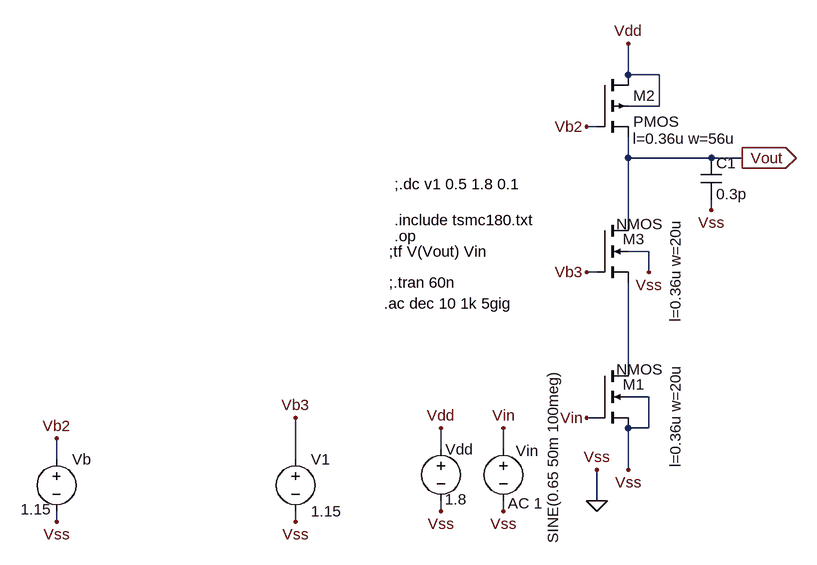
[diagram p0: schematic Cascode_CSA with current source with 1Ghz.asc]
Cascode_CSA with current source with 1Ghz.asc, the LTspice schematic file:
Version 4
SHEET 1 1056 680
WIRE 496 -368 496 -416
WIRE 544 -368 496 -368
WIRE 544 -320 544 -368
WIRE 544 -320 496 -320
WIRE 448 -288 432 -288
WIRE 496 -240 496 -272
WIRE 624 -240 496 -240
WIRE 672 -240 624 -240
WIRE 624 -160 624 -176
WIRE 496 -144 496 -240
WIRE 528 -96 496 -96
WIRE 448 -64 432 -64
WIRE 528 -64 528 -96
WIRE 496 80 496 -48
WIRE 528 128 496 128
WIRE 448 160 432 160
WIRE 528 176 528 128
WIRE 528 176 496 176
WIRE 208 208 208 176
WIRE 304 208 304 176
WIRE -384 224 -384 192
WIRE -16 224 -16 160
WIRE 496 240 496 176
WIRE 448 288 448 240
WIRE 208 304 208 288
WIRE 304 304 304 288
WIRE -384 320 -384 304
WIRE -16 320 -16 304
FLAG 448 288 0
FLAG 448 240 Vss
FLAG 304 176 Vin
FLAG 208 304 Vss
FLAG 304 304 Vss
FLAG 208 176 Vdd
FLAG 496 -416 Vdd
FLAG 496 240 Vss
FLAG 672 -240 Vout
IOPIN 672 -240 Out
FLAG 624 -160 Vss
FLAG 432 160 Vin
FLAG -384 320 Vss
FLAG -384 192 Vb2
FLAG 528 -64 Vss
FLAG 432 -64 Vb3
FLAG -16 320 Vss
FLAG -16 160 Vb3
FLAG 432 -288 Vb2
SYMBOL nmos4 448 80 R0
WINDOW 0 40 29 Left 2
WINDOW 3 30 6 Left 2
WINDOW 123 121 -2 VRight 2
SYMATTR InstName M1
SYMATTR Value2 l=0.36u w=20u
SYMBOL voltage 208 192 R0
WINDOW 123 0 0 Left 0
WINDOW 39 0 0 Left 0
WINDOW 0 7 17 Left 2
WINDOW 3 6 94 Left 2
SYMATTR InstName Vdd
SYMATTR Value 1.8
SYMBOL voltage 304 192 R0
WINDOW 0 19 19 Left 2
WINDOW 3 76 -106 VRight 2
WINDOW 123 7 100 Left 2
WINDOW 39 0 0 Left 0
SYMATTR InstName Vin
SYMATTR Value SINE(0.65 50m 100meg)
SYMATTR Value2 AC 1
SYMBOL cap 608 -240 R0
SYMATTR InstName C1
SYMATTR Value 0.3p
SYMBOL voltage -384 208 R0
WINDOW 123 0 0 Left 0
WINDOW 39 0 0 Left 0
WINDOW 3 -55 93 Left 2
SYMATTR Value 1.15
SYMATTR InstName Vb
SYMBOL nmos4 448 -144 R0
WINDOW 0 40 29 Left 2
WINDOW 3 30 6 Left 2
WINDOW 123 121 -2 VRight 2
SYMATTR InstName M3
SYMATTR Value2 l=0.36u w=20u
SYMBOL voltage -16 208 R0
WINDOW 123 0 0 Left 0
WINDOW 39 0 0 Left 0
SYMATTR InstName V1
SYMATTR Value 1.15
SYMBOL pmos4 448 -368 R0
WINDOW 123 55 98 Left 2
SYMATTR Value2 l=0.36u w=56u
SYMATTR InstName M2
TEXT 136 -144 Left 2 !.include tsmc180.txt
TEXT 136 -120 Left 2 !.op
TEXT 128 -96 Left 2 !;tf V(Vout) Vin
TEXT 120 -16 Left 2 !.ac dec 10 1k 5gig
TEXT 128 -48 Left 2 !;.tran 60n
TEXT 136 -200 Left 2 !;.dc v1 0.5 1.8 0.1

The netlist it stands for:
* Cascode_CSA with current source with 1Ghz.asc
M1 N001 Vin 0 0 NMOS l=0.36u w=20u
Vdd Vdd 0 1.8
Vin Vin 0 SINE(0.65 50m 100meg) AC 1
C1 Vout 0 0.3p
Vb Vb2 0 1.15
M3 Vout Vb3 N001 0 NMOS l=0.36u w=20u
V1 Vb3 0 1.15
M2 Vdd Vb2 Vout Vdd PMOS l=0.36u w=56u
.model NMOS NMOS
.model PMOS PMOS
.lib standard.mos
.include tsmc180.txt
.op
;tf V(Vout) Vin
.ac dec 10 1k 5gig
;.tran 60n
;.dc v1 0.5 1.8 0.1
.backanno
.end